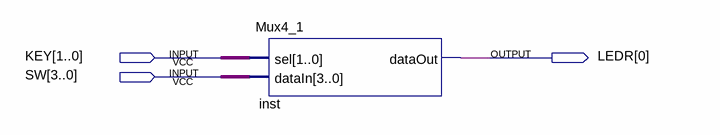
[diagram p0: schematic sheet]
// Quartus schematic Mux4_1Demo.bdf as structural Verilog: 1 symbols, 3 pins
module Mux4_1Demo (
  input  [1:0] KEY,
  input  [3:0] SW,
  output [0:0] LEDR
);

  Mux4_1 inst (.sel(KEY), .dataIn(SW), .dataOut(LEDR[0]));
endmodule
